# Altium schematic sheet OnOffCircuit.SchDoc
size A4; SheetNumber: 5; SheetTotal: 5
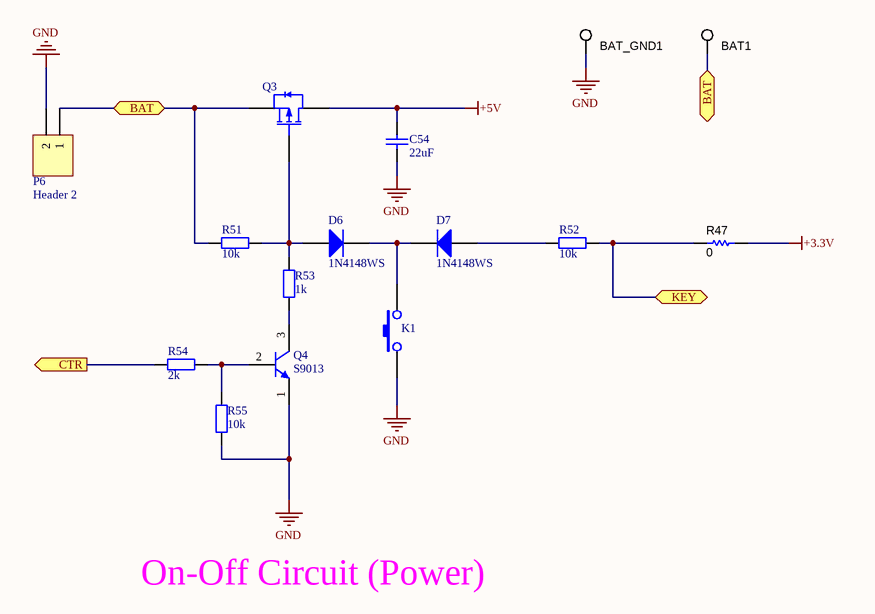
[diagram p0: OnOffCircuit.SchDoc]

## Parts
BAT1  5015  [Testpoint_Keystone_Miniature]  (value not drawn)
BAT_GND1  5015  [Testpoint_Keystone_Miniature]  (value not drawn)
C54  22uF  [0603]
D6  1N4148WS  [SOD-323]
D7  1N4148WS  [SOD-323]
K1  KEY-2  [KEY-6*6*9.5]  (value not drawn)
P6  Header 2  [XH254-2]
Q3  AO3401A P道沟 X13A15 SOT-23  [SOT-23-3L]  (value not drawn)
Q4  S9013  [SOT-23-3_L2.9-W1.3-P1.90-LS2.4-BR]
R47  value 0  [0805_R]  (hidden comment: CRCW06030000Z0EA)
R51  10k  [0805_R]
R52  10k  [0805_R]
R53  1k  [0805_R]
R54  2k  [0805_R]
R55  10k  [0805_R]

## Ports
BAT (bidir, see Insight[2C], STM32f103c8t6[3A]), CTR (out, see Insight[3C], STM32f103c8t6[2D]), KEY (bidir, see Insight[3C], STM32f103c8t6[2D])

## Nets
+3.3V: R47.2
+5V: C54.2 Q3.3(D)
GND: BAT_GND1.1 C54.1 K1.1 P6.2 Q4.1(E) R55.1
BAT: BAT1.1 P6.1 Q3.2(S) R51.1 ; port BAT
CTR: R54.2 ; port CTR
KEY: R47.1 R52.2 ; port KEY
NetD6_1: D6.1(A) Q3.1(G) R51.2 R53.2
NetD6_2: D6.2(K) D7.2(K) K1.2
NetD7_1: D7.1(A) R52.1
NetQ4_2: Q4.2(B) R54.1 R55.2
NetQ4_3: Q4.3(C) R53.1

## Notes on the sheet
- On-Off Circuit (Power)

## Library data of the parts
BAT1 BAT_GND1 = 5015: Test Point, Miniature, SMT; Manufacturer: Keystone; CompType: Test Point Loop; U/M: EA; SymbolVersion: 2008-07-10; PartNumber: 5015; Value: SMT; PackageReference: Testpoint_Keystone_Miniature; RoHS: Y; MountType: SMT; ComponentLink1Description: Datasheet Link; ComponentLink1URL: http://www.keyelco.com/userAssets/store/files/5015.PDF; Publisher: Texas Instruments; LatestRevisionDate: 2014-09-23; Supplier 1: Digi-Key; Supplier Part Number 1: 5015KCT-ND
C54 = Cap_0402: 0402贴片电容; Package: 0402; 常见贴片电容尺寸图: https://wenku.baidu.com/view/21d5206100f69e3143323968011ca300a6c3f6b2.html
D6 D7 = 1N4148WS_SOD-323: 二极管; ComponentLink1Description: 供应商链接; ComponentLink1URL: http://www.szlcsc.com/product/details_2485.html; Package: SOD-323; Supplier: LC; SuppliersPartNumber: C2128
P6 = Header 2: Header, 2-Pin; LatestRevisionDate: 17-Jul-2002; LatestRevisionNote: Re-released for DXP Platform.; Publisher: Altium Limited
Q3 = AO3401A P道沟 X13A15 SOT-23: MOS(场效应管); ComponentLink1Description: 供应商链接; ComponentLink1URL: http://www.szlcsc.com/product/details_15801.html; Package: SOT-23; Supplier: LC; SuppliersPartNumber: C15127
Q4 = 9013_TO-92: NPN型小功率三极管; 管脚判断: s9014,s9013，s9015，s9012，s9018系列的晶体小功率三极管，把显示文字平面朝自己，从左向右依次为e发射极 b基极 c集电极; HelpURL: https://baike.baidu.com/item/9013%E4%B8%89%E6%9E%81%E7%AE%A1/10925006?fr=aladdin
R47 = CRCW06030000Z0EA: RES, 0 ohm, 5%, 0.1W, 0603; Manufacturer: Vishay-Dale; CompType: Resistor; Value_Code: 0000; Tolerance_%: 5; Power_W: 0.1; VDC_V: 75; TempCo: 200 ppm/C; EIA_Code: E24; U/M: EA; SymbolVersion: 2009-05-29; PartNumber: CRCW06030000Z0EA; PackageReference: 0603; RoHS: Y; Res_ohm: 0; Value1: 5%; Value2: 0.1W; MountType: SMT; Technology: Thick Film; Published: 2008-06-26; Publisher: Texas Instruments; LatestRevisionDate: 2013-01-08; ComponentLink1Description: Datasheet link; ComponentLink1URL: http://www.vishay.com/docs/20035/dcrcwe3.pdf; Supplier 1: Digi-Key; Supplier Part Number 1: 541-0.0GCT-ND; Supplier 2: Mouser; Supplier Part Number 2: 71-CRCW0603-0-E3; Supplier 3: Farnell; Supplier Part Number 3: 1469739
R51-R55 = Res_0805: 0805贴片电阻; ComponentLink1Description: 供应商链接; ComponentLink1URL: http://www.szlcsc.com/product/details_26856.html; Package: 0805; Supplier: LC; SuppliersPartNumber: C26113